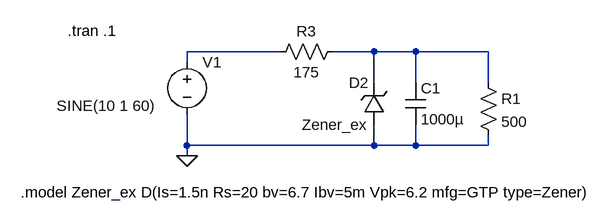
[diagram p0: schematic Diodo - Regulacado_Zener.asc]
Diodo - Regulacado_Zener.asc, the LTspice schematic file:
Version 4
SHEET 1 980 680
WIRE -48 128 -192 128
WIRE 96 128 32 128
WIRE 160 128 96 128
WIRE 272 128 160 128
WIRE -192 144 -192 128
WIRE 96 176 96 128
WIRE 160 176 160 128
WIRE 272 176 272 128
WIRE -192 272 -192 224
WIRE 96 272 96 240
WIRE 96 272 -192 272
WIRE 160 272 160 240
WIRE 160 272 96 272
WIRE 272 272 272 256
WIRE 272 272 160 272
WIRE -192 288 -192 272
FLAG -192 288 0
SYMBOL res 256 160 R0
SYMATTR InstName R1
SYMATTR Value 500
SYMBOL voltage -192 128 R0
WINDOW 3 -201 83 Left 2
SYMATTR Value SINE(10 1 60)
SYMATTR Value2 AC 0 0
SYMATTR SpiceLine Rser=0
SYMATTR InstName V1
SYMBOL res 48 112 R90
WINDOW 0 0 56 VBottom 2
WINDOW 3 32 56 VTop 2
SYMATTR InstName R3
SYMATTR Value 175
SYMBOL zener 112 240 R180
WINDOW 0 24 64 Left 2
WINDOW 3 24 0 Left 2
SYMATTR InstName D2
SYMATTR Value Zener_ex
SYMATTR Description Diode
SYMATTR Type diode
SYMBOL cap 144 176 R0
SYMATTR InstName C1
SYMATTR Value 1000µ
TEXT -376 96 Left 2 !.tran .1
TEXT -448 344 Left 2 !.model Zener_ex D(Is=1.5n Rs=20 bv=6.7 Ibv=5m Vpk=6.2 mfg=GTP type=Zener)

The netlist it stands for:
* Diodo - Regulacado_Zener.asc
R1 N002 0 500
V1 N001 0 SINE(10 1 60) AC 0 0 Rser=0
R3 N002 N001 175
D2 0 N002 Zener_ex
C1 N002 0 1000µ
.model D D
.lib standard.dio
.tran .1
.model Zener_ex D(Is=1.5n Rs=20 bv=6.7 Ibv=5m Vpk=6.2 mfg=GTP type=Zener)
.backanno
.end